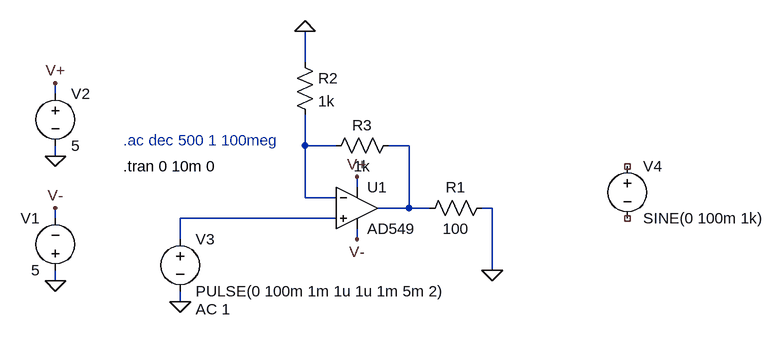
[diagram p0: schematic lab5_1.asc]
lab5_1.asc, the LTspice schematic file:
Version 4.1
SHEET 1 880 680
WIRE 128 -64 128 -112
WIRE -256 -16 -256 -32
WIRE 128 64 128 16
WIRE 176 64 128 64
WIRE 288 64 256 64
WIRE -256 80 -256 64
WIRE 208 128 208 112
WIRE 128 144 128 64
WIRE 176 144 128 144
WIRE 288 160 288 64
WIRE 288 160 240 160
WIRE 320 160 288 160
WIRE 416 160 400 160
WIRE -256 176 -256 160
WIRE 176 176 -64 176
WIRE -64 208 -64 176
WIRE 208 208 208 192
WIRE 416 256 416 160
WIRE -256 272 -256 256
WIRE -64 304 -64 288
FLAG 416 256 0
FLAG -256 272 0
FLAG -256 80 0
FLAG -256 -32 V+
FLAG -256 160 V-
FLAG 208 112 V+
FLAG 208 208 V-
FLAG -64 304 0
FLAG 128 -112 0
SYMBOL OpAmps\\AD549 208 96 R0
SYMATTR InstName U1
SYMBOL voltage -256 272 R180
WINDOW 0 24 96 Left 2
WINDOW 3 24 16 Left 2
WINDOW 123 0 0 Left 0
WINDOW 39 0 0 Left 0
SYMATTR InstName V1
SYMATTR Value 5
SYMBOL voltage -256 -32 R0
WINDOW 123 0 0 Left 0
WINDOW 39 0 0 Left 0
SYMATTR InstName V2
SYMATTR Value 5
SYMBOL res 416 144 R90
WINDOW 0 0 56 VBottom 2
WINDOW 3 32 56 VTop 2
SYMATTR InstName R1
SYMATTR Value 100
SYMBOL voltage -64 192 R0
WINDOW 123 24 124 Left 2
WINDOW 39 0 0 Left 0
SYMATTR InstName V3
SYMATTR Value PULSE(0 100m 1m 1u 1u 1m 5m 2)
SYMATTR Value2 AC 1
SYMBOL res 112 -80 R0
SYMATTR InstName R2
SYMATTR Value 1k
SYMBOL res 272 48 R90
WINDOW 0 0 56 VBottom 2
WINDOW 3 32 56 VTop 2
SYMATTR InstName R3
SYMATTR Value 1k
SYMBOL voltage 624 80 R0
WINDOW 123 0 0 Left 0
WINDOW 39 0 0 Left 0
SYMATTR InstName V4
SYMATTR Value SINE(0 100m 1k)
TEXT -152 56 Left 2 ;.ac dec 500 1 100meg
TEXT -152 96 Left 2 !.tran 0 10m 0

The netlist it stands for:
* lab5_1.asc
X§U1 N003 N001 V+ V- N002 AD549  ; pins In+ In- V+ V- OUT
V1 0 V- 5
V2 V+ 0 5
R1 0 N002 100
V3 N003 0 PULSE(0 100m 1m 1u 1u 1m 5m 2) AC 1
R2 0 N001 1k
R3 N002 N001 1k
V4 NC_01 NC_02 SINE(0 100m 1k)
* .ac dec 500 1 100meg
.tran 0 10m 0
.backanno
.end